# Altium schematic sheet switcher-3A.SchDoc
size A4; SheetNumber: 41; SheetTotal: 71
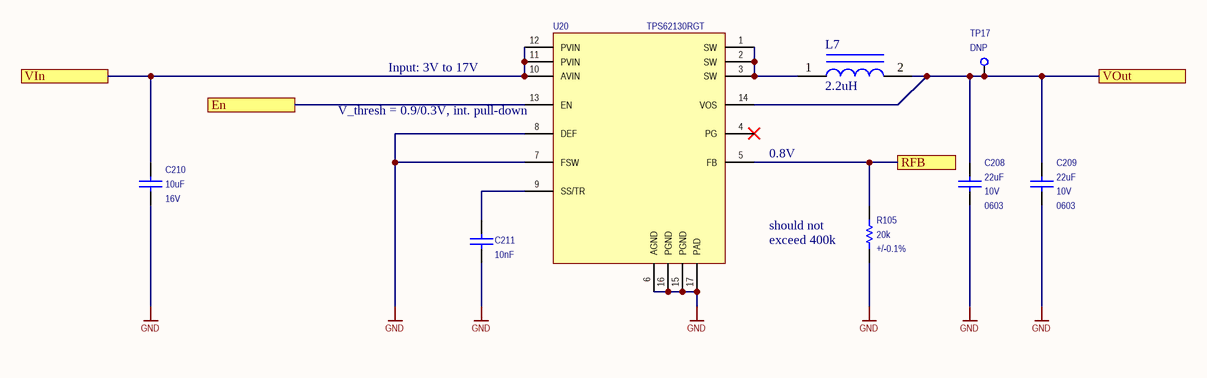
[diagram p0: switcher-3A.SchDoc]

## Parts
C208  value 22uF  Voltage: 10V  [0603]  (hidden comment: C1608X5R1A226M080AC)
C209  value 22uF  Voltage: 10V  [0603]  (hidden comment: C1608X5R1A226M080AC)
C210  value 10uF  Voltage: 16V  [0603]  (hidden comment: CAP 10UF 0603)
C211  value 10nF  [0201]  (hidden comment: CAP 10NF 0201)
L7  value 2.2uH  [SRP4020]  (hidden comment: Ind 2.2uH 4A SRP4020)
R105  value 20k  Tolerance: +/-0.1%  [RESC1608X55N]  (hidden comment: RES 0603 20k 0.1%)
TP17  Do Not Place: DNP  [TEST_POINT]  (hidden comment: TEST_POINT)
U20  TPS62130RGT  [S-PQFP-8N]

## Ports
En, RFB, VIn, VOut

## Nets
GND: C208.1 C209.1 C210.1 C211.2 R105.1 U20.6(AGND) U20.7(FSW) U20.8(DEF) U20.15(PGND) U20.16(PGND) U20.17(PAD)
En: U20.13(EN) ; port En
RFB: R105.2 U20.5(FB) ; port RFB
VIn: C210.2 U20.10(AVIN) U20.11(PVIN) U20.12(PVIN) ; port VIn
VOut: C208.2 C209.2 L7.2 TP17.1 U20.14(VOS) ; port VOut
NetC211_1: C211.1 U20.9(SS/TR)
NetL7_1: L7.1 U20.1(SW) U20.2(SW) U20.3(SW)

Not connected (* = marked no-connect by the designer): U20 4(PG)*

## Notes on the sheet
- (near U20) V_thresh = 0.9/0.3V, int. pull-down
- Input: 3V to 17V
- (near U20) 0.8V
- should not
- exceed 400k

## Library data of the parts
C208 C209 = CAP: Ceramic Capacitor 22uF +/-20% 10V X5R SMD 0603; Manufacturer: TDK Corporation; Tr: -55:85; Manufacturer P/N: C1608X5R1A226M080AC; Tolerance: +/-20%
C210 = CAP: Ceramic Capacitor 10uF +/-20% 16V X5R 0603; Manufacturer: Taiyo Yuden; Manufacturer P/N: EMK107BBJ106MA-T; Tolerance: *; Footprint: *; Tr: *; Distributor: Digi-Key; Distributor P/N: *
C211 = CAP: Ceramic Capacitor 10nF +/-10% 10V X5R 0201; Manufacturer: TDK Corporation; Manufacturer P/N: C0603X5R1A103K030BA; Tolerance: *; Voltage: 10V; Footprint: *; Tr: *; Distributor: Digi-Key; Distributor P/N: *
L7 = SRP4020TA-2R2M: Dist: Digi-Key; Dist P/N: SRP4020TA-2R2MCT-ND; Mfg: Bourns; Mfgr P/N: SRP4020TA-2R2M; Price: 1.18; HelpURL: http://www.bourns.com/docs/Product-Datasheets/SRP4020TA.pdf
R105 = RES 0603 10k 1%: Thick Film Resistor 20k Ohms +/-0.1% 0.1W 75V SMD 0603; Manufacturer: Panasonic - ECG; Manufacturer P/N: ERA-3APB203V; Tcr: +/-15; Tr: -55:+125; Alternatives: *; Voltage: 75V; Power: 0.1W; Footprint: 0603; P/N: ERA-3APB203V
TP17 = TEST_POINT: Thruhole Miniature Test Point; Manufacturer P/N: 5000; Manufacturer: Keystone Electronics Corp
U20 = TPS62130RGT: 3-17V 3A Step-Down Converter VQFN; Manufacturer: Texas Instruments; Manufacturer P/N: TPS62130RGT